# EasyEDA Pro project ProProject_STLink-Edge-v3_2024-03-31.epro

# Schematic st-link  v2-1_1
Create Date: 2024-03-31; Page Name: ST-LINK V2-1; Project Name: ST-LINK V2-1_TYPE-C-edge; Schematic Name: st-link  v2-1_1; Update Date: 2024-03-31; Company: 攻城狮晨哲; Drawed: 沈工; Page Size: A4; Part Number: PCB-002; Reviewed: 沈工; Version: V2.0.1
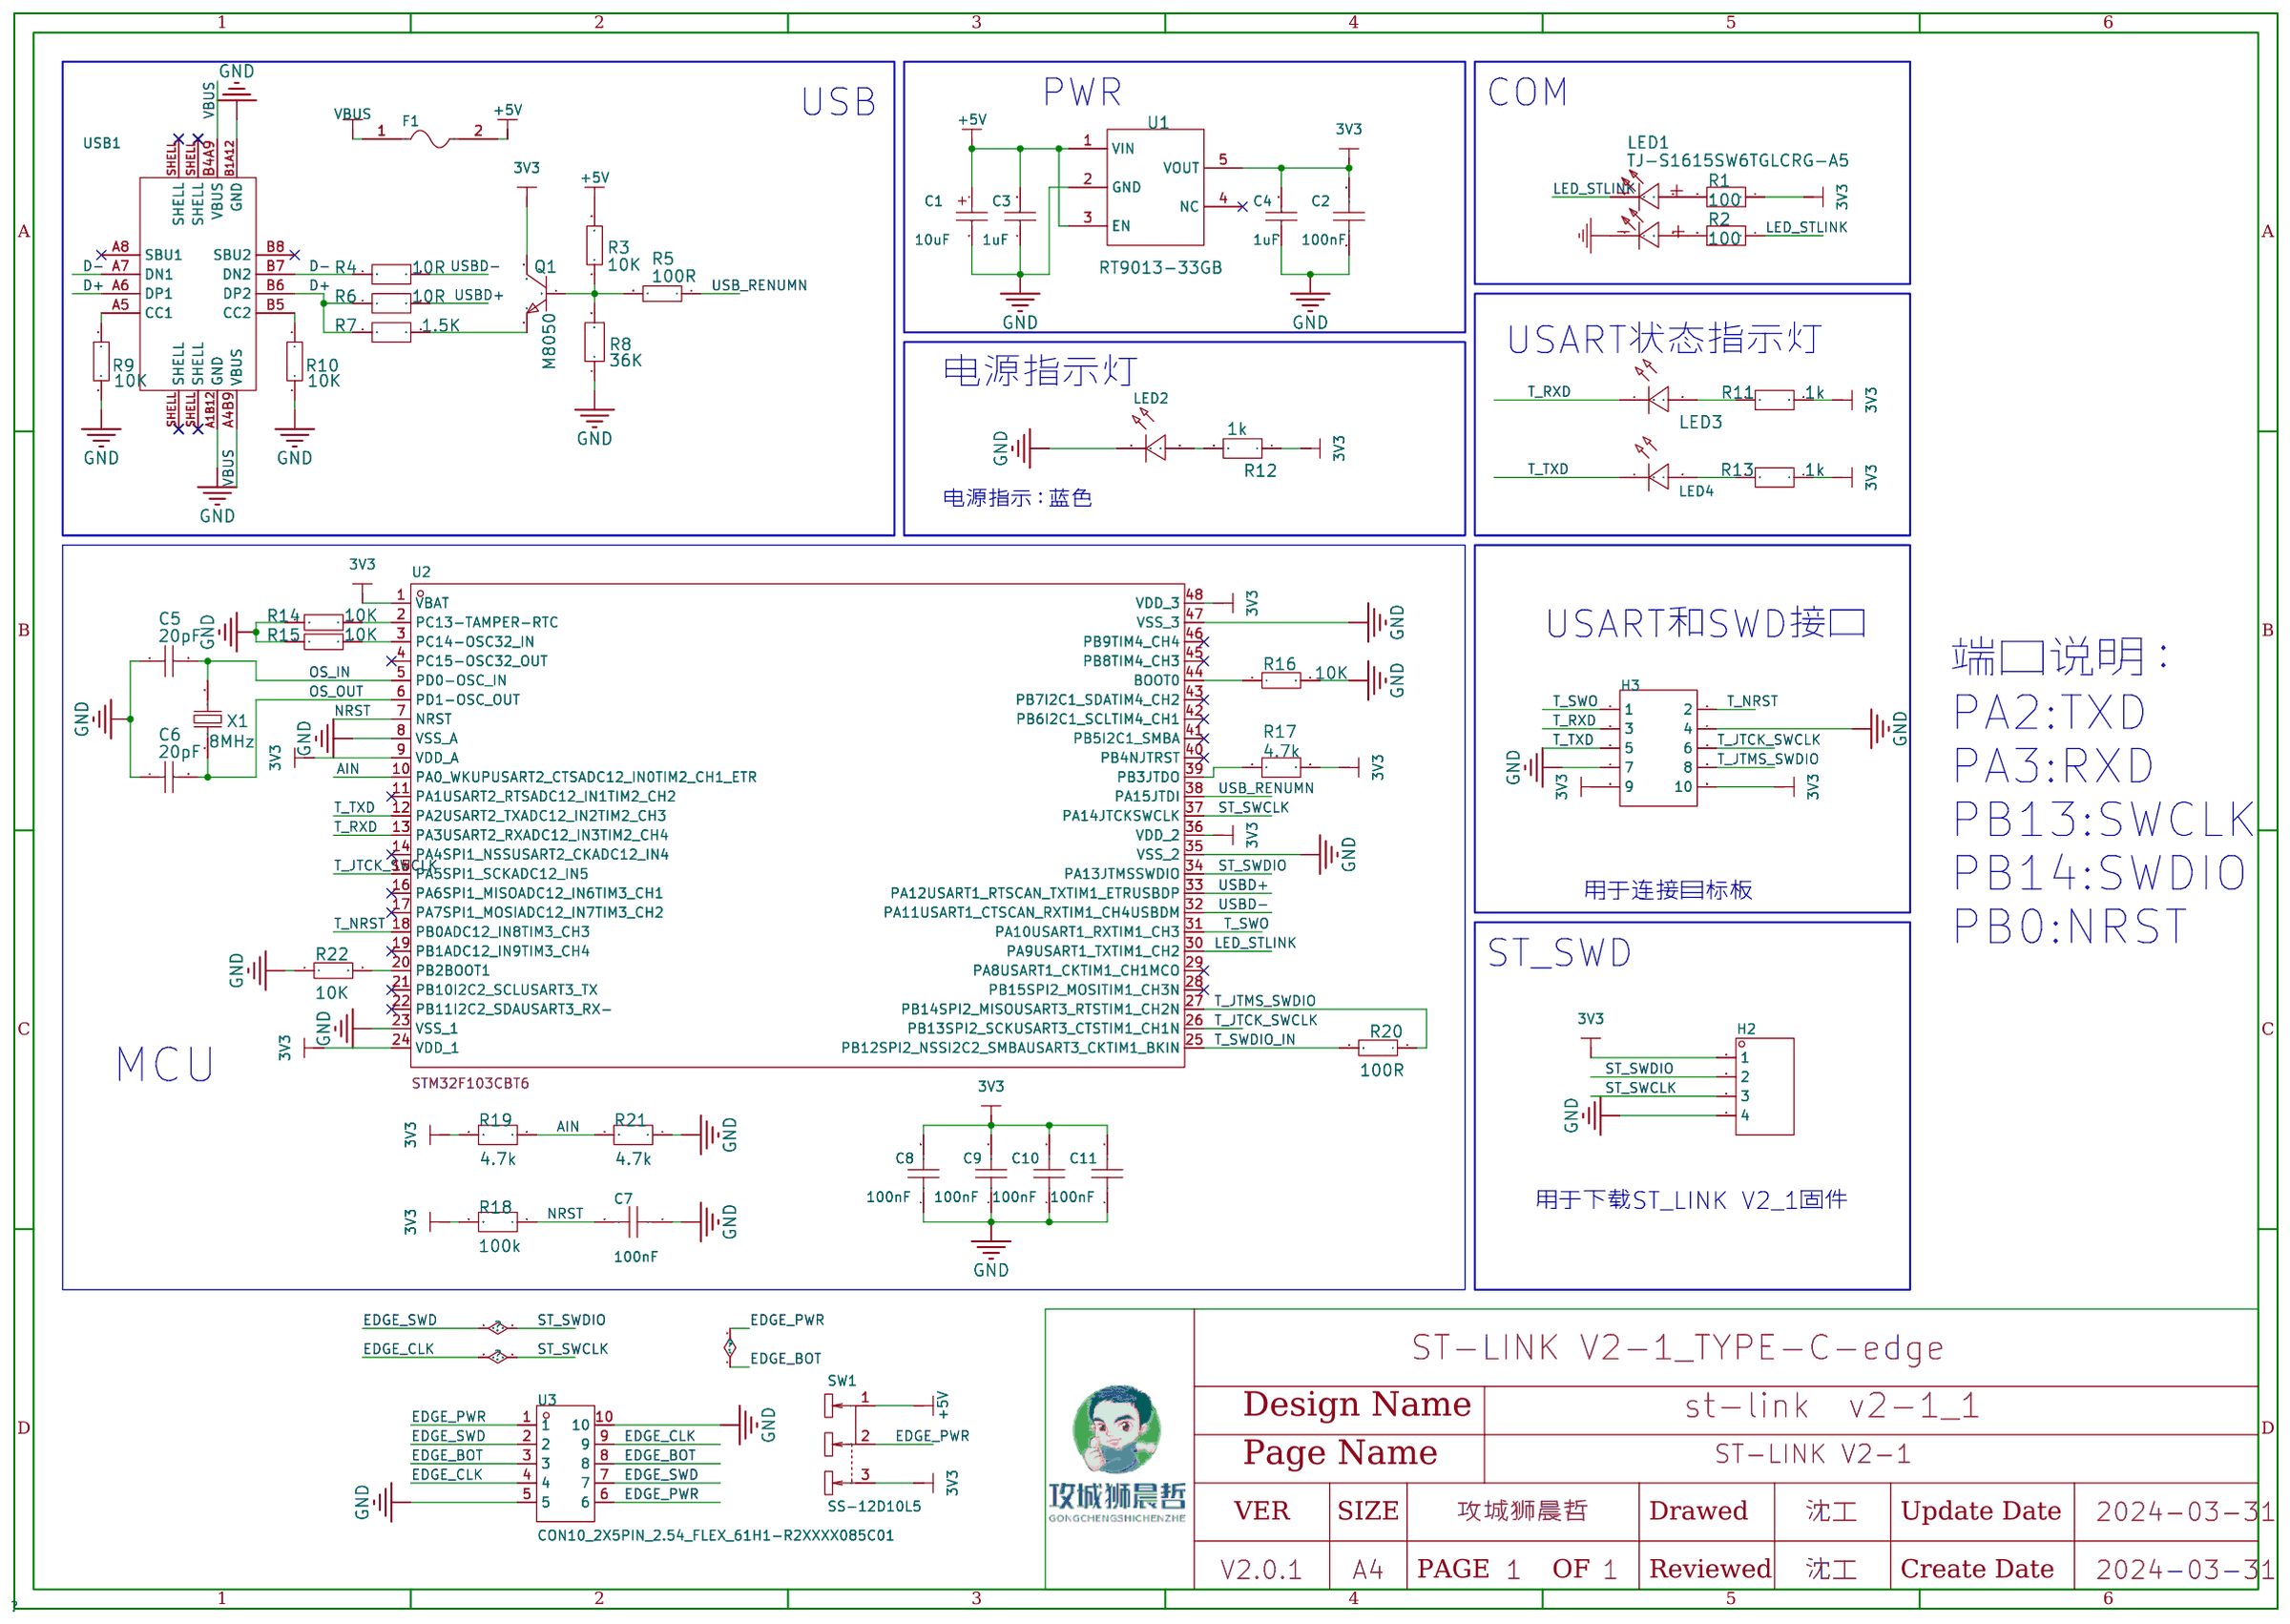
[diagram p0: schematic sheet]

## Parts
C1  10uF  [CASE-A_3216]
C2  100nF  [C0603]
C3  1uF  [C0603]
C4  1uF  [C0603]
C5  20pF  [C0603]
C6  20pF  [C0603]
C7  100nF  [C0603]
C8  100nF  [C0603]
C9  100nF  [C0603]
C10  100nF  [C0603]
C11  100nF  [C0603]
F1  nSMD050  [F1206]
H2  -  [HDR-TH_4P-P2.54-V-M]
H3  -  [HDR-TH_SMD-10P-P2.54]
LED1  TJ-S1615SW6TGLCRG-A5  [LED-ARRAY-SMD_4P-L1.6-W1.5-TR-RD_TJ-S1615SW6TGLCRB-A5]
LED2  -  [LED0603]
LED3  -  [LED0603]
LED4  -  [LED0603]
Q1  M8050  [SOT-23(SOT-23-3)]
R1  100  [R0603]
R2  100  [R0603]
R3  10K  [R0603]
R4  10R  [R0603]
R5  100R  [R0603]
R6  10R  [R0603]
R7  1.5K  [R0603]
R8  36K  [R0603]
R9  10K  [R0603]
R10  10K  [R0603]
R11  1k  [R0603]
R12  1k  [R0603]
R13  1k  [R0603]
R14  10K  [R0603]
R15  10K  [R0603]
R16  10K  [R0603]
R17  4.7k  [R0603]
R18  100k  [R0603]
R19  4.7k  [R0603]
R20  100R  [R0603]
R21  4.7k  [R0603]
R22  10K  [R0603]
SW1  SS-12D10L5  [SW-TH_SS-12D10L5]
U1  RT9013-33GB  [SOT-23-5_L3.0-W1.7-P0.95-LS2.8-BR]
U2  -  [LQFP-48_L7.0-W7.0-P0.50-LS9.0-BL]
U3  CON10_2X5PIN_2.54_FLEX_61H1-R2XXXX085C01  [CONN-TH_10P-P2.54-2X5PIN_2.54_FLEX_61H1]
USB1  -  [USB-3.1-SMD_U262-161N-4BVC11]
X1  8MHz  [OSC-SMD_L5.0-W3.2]

## Library data of the parts
C1 = TAJA106K016RNJ: 容值:10uF;精度:±10%;额定电压:16V;等效串联电阻:3Ω@100kHz;工作温度:-55~+125;; LCSC Part Name: 10uF ±10% 16V; Supplier Part: C7171; Manufacturer: Kyocera AVX; JLCPCB Part Class: Basic Part; Datasheet: https://atta.szlcsc.com/upload/public/pdf/source/20160107/1457707748093.pdf; Supplier: LCSC; Tolerance: ±10%; Rated Voltage: 16V; Equivalent Series Resistance(ESR): 3Ω@100kHz; Operating Temperature: -55~+125
C2 C7-C11 = CC0603KRX7R9BB104: 容值:100nF;精度:±10%;额定电压:50V;温度系数:X7R;; LCSC Part Name: 100nF ±10% 50V; Supplier Part: C14663; Manufacturer: YAGEO(国巨); Supplier Footprint: 0603; JLCPCB Part Class: Basic Part; Datasheet: https://atta.szlcsc.com/upload/public/pdf/source/20170116/1484561234239.pdf; Supplier: LCSC; Tolerance: ±10%; Voltage Rated: 50V; Temperature Coefficient: X7R
C3 C4 = CL10A105KB8NNNC: 容值:1uF;精度:±10%;额定电压:50V;温度系数:X5R;; LCSC Part Name: 1uF ±10% 50V; Supplier Part: C15849; Manufacturer: SAMSUNG(三星); Supplier Footprint: 0603; JLCPCB Part Class: Basic Part; Datasheet: https://atta.szlcsc.com/upload/public/pdf/source/20160103/1457707679084.pdf; Supplier: LCSC; Tolerance: ±10%; Voltage Rated: 50V; Temperature Coefficient: X5R
C5 C6 = 20pF: Supplier: LCSC; Manufacturer Part: CL10C220JB8NNNC; Manufacturer: SAMSUNG; Supplier Part: C1653
F1 = nSMD050: 最大电压:6V;最大电流:100A;保持电流:500mA;跳闸电流:1A;; LCSC Part Name: 0.5A 6V  自恢复保险丝; Supplier Part: C69688; Manufacturer: 台湾陆海; Supplier Footprint: 1206; JLCPCB Part Class: Extended Part; Datasheet: https://atta.szlcsc.com/upload/public/pdf/source/20160331/1459396375403.pdf; Supplier: LCSC; Operating Voltage (Max): 6V; Current Rating (Max): 100A; Hold Current: 500mA; Trip Current: 1A
H2 = B-2100S04P-A110: 间距:2.54mm;总PIN位数:4;排数:1;插针结构:1x4P;行距:-;安装类型:直插;圆针/方针:-;额定电流:-;额定电压:-;配合针长度:6mm;塑高:2.54mm;端接针长度:3mm;触头材质:黄铜;触头镀层:-;工作温度范围:-40~+105;颜色:黑色;; LCSC Part Name: 2.54mm 1x4P; Supplier Part: C124378; Manufacturer: Ckmtw(灿科盟); Supplier Footprint: 插件,P=2.54mm; JLCPCB Part Class: Extended Part; Datasheet: https://atta.szlcsc.com/upload/public/pdf/source/20170821/C124378_1503303307508901532.pdf; Supplier: LCSC; Pitch: 2.54mm; Number of Pins: 4; Number of Rows: 1; Pin Structure: 1x4P; Mounting Type: 直插; Length of Mating Pin: 6mm; Insulation Height: 2.54mm; Length of End Connection Pin: 3mm; Contact Material: 黄铜; Operating Temperature Range: -40~+105; Color: 黑色
H3 = 2*5P header: Supplier: LCSC
LED1 = TJ-S1615SW6TGLCRG-A5: Supplier: LCSC; Supplier Part: C273605; Manufacturer: TOGIALED
LED2 = LED-0603-B
LED3 = LED-0603-R
LED4 = LED-0603-G
Q1 = M8050_C266599: Supplier: LCSC; Supplier Part: C266599; Manufacturer: Bourne Semicon (Shenzhen)
R1 R2 R11-R13 = 1k: Manufacturer Part: RC0603FR-071KL; Supplier: LCSC; Manufacturer: YAGEO; Supplier Part: C22548
R3 R9 R10 R14-R16 R22 = 10K: Supplier: LCSC; Manufacturer: YAGEO; Manufacturer Part: AC0603FR-0710KL; Supplier Part: C116677
R4 R6 = 10R: Manufacturer Part: RC0603FR-0710RL; Supplier: LCSC; Manufacturer: YAGEO; Supplier Part: C109318
R5 R20 = 100R: Supplier: LCSC; Supplier Part: C105588; Manufacturer: YAGEO; Manufacturer Part: RC0603FR-07100RL
R7 = 1.5K: Manufacturer Part: RC0603FR-071K5L; Supplier: LCSC; Manufacturer: YAGEO; Supplier Part: C114668
R8 = 36K: Manufacturer Part: AC0603FR-0736KL; Supplier: LCSC; Manufacturer: YAGEO; Supplier Part: C227841
R17 R19 R21 = 4.7k: Manufacturer Part: AC0603FR-074K7L; Supplier: LCSC; Manufacturer: YAGEO; Supplier Part: C116697
R18 = 100k: Manufacturer Part: AC0603FR-07100KL; Supplier: LCSC; Manufacturer: YAGEO; Supplier Part: C116674
SW1 = SS-12D10L5: 电路结构:单刀双掷;安装方式:直插;开关颜色:黑色;额定电流(DC):3A;额定电压(DC):125V;额定电流(AC):3A;额定电压(AC):125V;机械寿命:1万次;; LCSC Part Name: 柄长5mm 直插双档 滑动开关; Supplier Part: C319012; Manufacturer: XKB Connectivity(中国星坤); Supplier Footprint: 插件; JLCPCB Part Class: 扩展库; Datasheet: https://atta.szlcsc.com/upload/public/pdf/source/20211009/D6412F37AABE6F9459A6EE7FA4DAEADB.pdf; Supplier: LCSC; Circuit: 单刀双掷; Actuator Style: 矩形柱状; Pin Style: PC引脚; Switch Length: 13mm; Switch Width: 6.8mm; Switch Height: 6.4mm; Mounting Style: 直插; Actuator Color: 黑色; Current Rating (DC): 3A; Voltage Rating (DC): 125V; Current Rating (AC): 3A; Voltage Rating (AC): 125V; Mechanical Life: 1万次; Operating Temperature: -40℃~+85℃
U1 = RT9013-33GB: Supplier: LCSC; Manufacturer: RICHTEK; image: //image.lceda.cn/szlcsc/C47773.jpg; Supplier Part: C47773
U2 = STM32F103CBT6: 主频（MAX):72MHz;工作电压:2V ~ 3.6V;; Supplier Part: C8304; Manufacturer: ST(意法半导体); Supplier Footprint: LQFP-48_7x7x05P; JLCPCB Part Class: Extended Part; Datasheet: https://atta.szlcsc.com/upload/public/pdf/source/20140724/1457707170379.pdf; Supplier: LCSC; Speed: 72MHz; Voltage - Supply (Vcc/Vdd): 2V ~ 3.6V; RAM Size: 20KB; Number of I/O: 37; A/D: 16x12bit; PWM: 13; UART/USART: 3 USART; I2C（SMBUS/PMBUS）: 2; USB Device: 1; CAN: 1
U3 = CON10_2X5PIN_2.54_FLEX_61H1-R2XXXX085C01: Supplier Part: C9900013345; Supplier Footprint: 2X5PIN_2.54_FLEX_61H1; JLCPCB Part Class: 扩展库; Supplier: LCSC
USB1 = U262-161N-4BVC11: 连接器类型:Type-C;标准:-;公母:母座;触点数量:16;端口数量:1;; LCSC Part Name: Type-C 母座; Supplier Part: C319148; Manufacturer: XKB Connectivity(中国星坤); Supplier Footprint: SMD; JLCPCB Part Class: Extended Part; Datasheet: https://atta.szlcsc.com/upload/public/pdf/source/20211015/B478CBA0F1623DA36A6CC6918C49C838.pdf; Supplier: LCSC; Connector Type: Type-C; Gender: 母座; Number of Contacts: 16; Number of Ports: 1
X1 = 8MHz: Supplier: LCSC; Manufacturer: TXC; Manufacturer Part: 7A0808LCSC-AHK2G; Supplier Part: C111120

## Nets
3V3: C2.2 C4.2 C8.2 C9.2 C10.2 C11.2 H2.1 H3.9 H3.10 Q1.3(C) R1.1 R11.1 R12.1 R13.1 R17.1 R18.2 R19.2 SW1.3 U1.5(VOUT) U2.1(VBAT) U2.9(VDD_A) U2.24(VDD_1) U2.36(VDD_2) U2.48(VDD_3)
+5V: C1.1 C3.2 F1.2 R3.2 SW1.1 U1.1(VIN) U1.3(EN)
GND: C1.2 C2.1 C3.1 C4.1 C5.1 C6.1 C7.1 C8.1 C9.1 C10.1 C11.1 H2.4 H3.4 H3.7 LED1.4 LED2.1(C) R8.1 R9.1 R10.1 R14.1 R15.1 R16.2 R21.1 R22.1 U1.2(GND) U2.8(VSS_A) U2.23(VSS_1) U2.35(VSS_2) U2.47(VSS_3) U3.5 U3.10 USB1.A1B12(GND) USB1.B1A12(GND)
VBUS: F1.1 USB1.A4B9(VBUS) USB1.B4A9(VBUS)
AIN: R19.1 R21.2 U2.10(PA0_WKUPUSART2_CTSADC12_IN0TIM2_CH1_ETR)
D+: R6.1 R7.1 USB1.A6(DP1) USB1.B6(DP2)
D-: R4.1 USB1.A7(DN1) USB1.B7(DN2)
EDGE_BOT: SW1.2 U3.1 U3.3 U3.6 U3.8
EDGE_CLK: H2.3 U2.37(PA14JTCKSWCLK) U3.4 U3.9
EDGE_SWD: H2.2 U2.34(PA13JTMSSWDIO) U3.2 U3.7
LED_STLINK: LED1.2 R2.1 U2.30(PA9USART1_TXTIM1_CH2)
NRST: C7.2 R18.1 U2.7(NRST)
OS_IN: C5.2 U2.5(PD0-OSC_IN) X1.2
OS_OUT: C6.2 U2.6(PD1-OSC_OUT) X1.1
T_JTCK_SWCLK: H3.6 U2.15(PA5SPI1_SCKADC12_IN5) U2.26(PB13SPI2_SCKUSART3_CTSTIM1_CH1N)
T_JTMS_SWDIO: H3.8 R20.1 U2.27(PB14SPI2_MISOUSART3_RTSTIM1_CH2N)
T_NRST: H3.2 U2.18(PB0ADC12_IN8TIM3_CH3)
T_RXD: H3.3 LED3.1(C) U2.13(PA3USART2_RXADC12_IN3TIM2_CH4)
T_SWDIO_IN: R20.2 U2.25(PB12SPI2_NSSI2C2_SMBAUSART3_CKTIM1_BKIN)
T_SWO: H3.1 U2.31(PA10USART1_RXTIM1_CH3)
T_TXD: H3.5 LED4.1(C) U2.12(PA2USART2_TXADC12_IN2TIM2_CH3)
USB_RENUMN: R5.1 U2.38(PA15JTDI)
USBD+: R6.2 U2.33(PA12USART1_RTSCAN_TXTIM1_ETRUSBDP)
USBD-: R4.2 U2.32(PA11USART1_CTSCAN_RXTIM1_CH4USBDM)
$1N38: R15.2 U2.3(PC14-OSC32_IN)
$1N350: Q1.2(E) R7.2
$1N367: Q1.1(B) R3.1 R5.2 R8.2
$1N516: R17.2 U2.39(PB3JTDO)
$1N517: R16.1 U2.44(BOOT0)
$1N690: LED2.2(A) R12.2
$1N8682: R9.2 USB1.A5(CC1)
$1N8780: R10.2 USB1.B5(CC2)
$1N17783: LED1.1 R1.2
$1N17836: LED1.3 R2.2
$1N45552: R14.2 U2.2(PC13-TAMPER-RTC)
$1N58058: R22.2 U2.20(PB2BOOT1)
Net-(LED3-2): LED3.2(A) R11.2
Net-(LED4-2): LED4.2(A) R13.2

Not connected (* = marked no-connect by the designer): U1 4(NC)*; U2 4(PC15-OSC32_OUT)* 11(PA1USART2_RTSADC12_IN1TIM2_CH2)* 14(PA4SPI1_NSSUSART2_CKADC12_IN4)* 16(PA6SPI1_MISOADC12_IN6TIM3_CH1)* 17(PA7SPI1_MOSIADC12_IN7TIM3_CH2)* 19(PB1ADC12_IN9TIM3_CH4)* 21(PB10I2C2_SCLUSART3_TX)* 22(PB11I2C2_SDAUSART3_RX-)* 28(PB15SPI2_MOSITIM1_CH3N)* 29(PA8USART1_CKTIM1_CH1MCO)* 40(PB4NJTRST)* 41(PB5I2C1_SMBA)* 42(PB6I2C1_SCLTIM4_CH1)* 43(PB7I2C1_SDATIM4_CH2)* 45(PB8TIM4_CH3)* 46(PB9TIM4_CH4)*; USB1 A8(SBU1)* B8(SBU2)* SHELL*

## Notes on the sheet
- PWR
- COM
- USB
- USART状态指示灯
- 电源指示灯
- 电源指示：蓝色
- USART和SWD接口
- 端口说明：
  PA2:TXD
  PA3:RXD
  PB13:SWCLK
  PB14:SWDIO
  PB0:NRST
- 用于连接目标板
- ST_SWD
- MCU
- 用于下载ST_LINK V2_1固件

# Board ST-LINK  V2-1_1
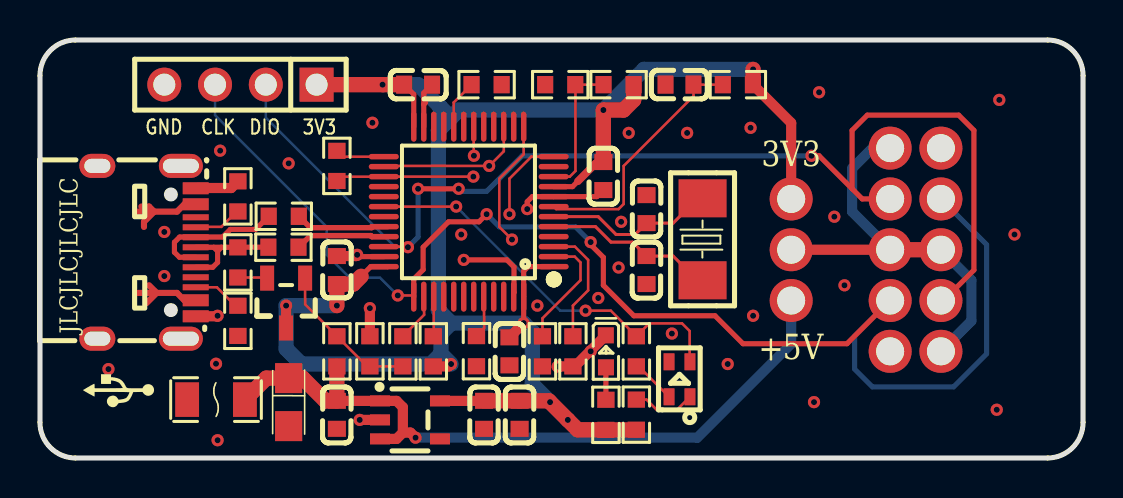
[diagram p1: board, top side]
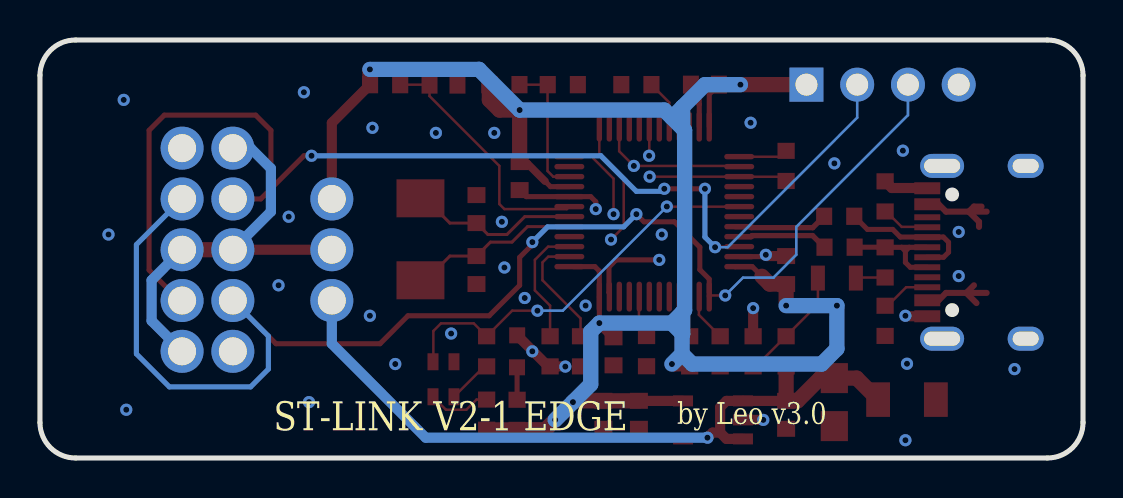
[diagram p2: board, bottom side, seen from below]

Outline 52.19 x 20.9 mm; copper layers: Top Layer, Bottom Layer. Coordinates in mm from the lower left corner of the outline.
Outline path: 0,19.12 0,1.78 arc(0.52,0.52) 1.78,0 50.42,0 arc(51.67,0.52) 52.19,1.78 52.19,19.12 arc(51.67,20.38) 50.42,20.9 1.78,20.9 arc(0.52,20.38) 0,19.12
Stack: Top Layer 0.035mm / Dielectric1 1.51mm FR4 er 4.5 / Bottom Layer 0.035mm

## Design rules (mm)
net USBD-: DP2_USB
net USBD+: DP2_USB
spacing W5 (default): track to track 0.127, other pairs 0.127 to 0.152
track width W5 (default): min 0.127, default 0.127, max 0.254
track width W10: min 0.127, default 0.254, max 2.54
track width W20: min 0.127, default 0.508, max 2.54
differential pair DIFF100 (default): width min 0.127, default 0.267, max 2.54; gap min 0.102, default 0.127
via via6-3 (default): diameter min 0.5, default 0.61, max 10; hole min 0.3, default 0.305, max 5.999
via via8-BGA-16: diameter min 0.406, default 0.406, max 0.406; hole min 0.203, default 0.203, max 0.203
via via8-4: diameter min 0.5, default 0.81, max 10; hole min 0.3, default 0.405, max 6
via VIA12-8: diameter min 0.5, default 1.199, max 10; hole min 0.3, default 0.8, max 5.999
net 3V3 uses W10
net VBUS uses VBUS, W20
net GND uses W20
net +5V uses W20

## Placement (name value [footprint] x y rotation side)
C1  10uF  [CASE-A_3216]  12.44 2.79 270 top
C2  100nF  [C0603]  24 2.16 90 top
C3  1uF  [C0603]  14.86 2.16 90 top
C4  1uF  [C0603]  22.22 2.16 90 top
C5  20pF  [C0603]  30.35 9.4 90 top
C6  20pF  [C0603]  30.35 12.45 270 top
C7  100nF  [C0603]  32 18.67 0 top
C8  100nF  [C0603]  28.19 14.1 90 top
C9  100nF  [C0603]  14.86 9.4 270 top
C10  100nF  [C0603]  23.49 5.33 90 top
C11  100nF  [C0603]  18.92 18.67 180 top
F1  nSMD050  [F1206]  8.81 2.92 0 top
H2  -  [HDR-TH_4P-P2.54-V-M]  10.03 18.67 180 top
LED1  TJ-S1615SW6TGLCRG-A5  [LED-ARRAY-SMD_4P-L1.6-W1.5-TR-RD_TJ-S1615SW6TGLCRB-A5]  32 3.94 270 top
LED2  -  [LED0603]  28.32 5.33 270 top
Q1  M8050  [SOT-23(SOT-23-3)]  12.32 6.48 180 top
R1  100  [R0603]  29.84 2.17 90 top
R2  100  [R0603]  29.84 5.33 270 top
R3  10K  [R0603]  14.86 5.33 270 top
R4  10R  [R0603]  12.2 12.09 0 top
R5  100R  [R0603]  18.16 5.33 270 top
R6  10R  [R0603]  12.18 10.54 0 top
R7  1.5K  [R0603]  9.9 9.78 270 top
R8  36K  [R0603]  16.51 5.33 270 top
R9  10K  [R0603]  9.9 13.08 270 top
R10  10K  [R0603]  9.9 6.86 90 top
R12  1k  [R0603]  28.32 2.16 90 top
R14  10K  [R0603]  25.14 5.33 90 top
R15  10K  [R0603]  26.67 5.33 90 top
R16  10K  [R0603]  21.84 5.34 270 top
R17  4.7k  [R0603]  19.68 5.33 90 top
R18  100k  [R0603]  34.92 18.67 0 top
R19  4.7k  [R0603]  28.95 18.67 0 top
R20  100R  [R0603]  14.86 14.61 90 top
R21  4.7k  [R0603]  26.03 18.67 0 top
R22  10K  [R0603]  22.35 18.67 180 top
SW1  SS-12D10L5  [SW-TH_SS-12D10L5]  37.59 10.41 90 top
U1  RT9013-33GB  [SOT-23-5_L3.0-W1.7-P0.95-LS2.8-BR]  18.52 1.91 180 top
U2  -  [LQFP-48_L7.0-W7.0-P0.50-LS9.0-BL]  21.45 12.32 90 top
U3  CON10_2X5PIN_2.54_FLEX_61H1-R2XXXX085C01  [CONN-TH_10P-P2.54-2X5PIN_2.54_FLEX_61H1]  45.08 10.41 0 top
USB1  -  [USB-3.1-SMD_U262-161N-4BVC11]  5.33 10.29 270 top
X1  8MHz  [OSC-SMD_L5.0-W3.2]  33.16 10.94 270 top

## Footprints (pads in the part's own frame, mm; a bottom-side part is the same pattern mirrored in y, then rotated)
C0603
  rect 0.8x0.9 smd: 1(-0.7,0) 2(0.7,0)
CASE-A_3216
  rect 1.5x1.359 smd: 1(-1.2,0) 2(1.2,0)
CONN-TH_10P-P2.54-2X5PIN_2.54_FLEX_61H1
  round 2.15 hole 1.4: 1(-2.54,5.08) 2(-2.54,2.54) 3(-2.54,0) 4(-2.54,-2.54) 5(-2.54,-5.08) 6(0,-5.08) 7(0,-2.54) 8(0,0) 9(0,2.54) 10(0,5.08)
F1206
  rect 1.192x1.727 smd: 1(-1.446,0) 2(1.446,0)
HDR-TH_4P-P2.54-V-M
  rect 1.7x1.7 hole 1.1: 1(-3.81,0)
  round 1.7 hole 1.1: 2(-1.27,0) 3(1.27,0) 4(3.81,0)
LED0603
  rect 0.8x0.8 smd: 1(-0.799,-0.004) 2(0.799,0.004)
LED-ARRAY-SMD_4P-L1.6-W1.5-TR-RD_TJ-S1615SW6TGLCRB-A5
  rect 0.85x0.55 smd: 1(0.875,0.525) 2(-0.875,0.525) 3(0.875,-0.525) 4(-0.875,-0.525)
LQFP-48_L7.0-W7.0-P0.50-LS9.0-BL
  oval 0.27x1.5 smd: 1(-2.75,-4.25) 2(-2.25,-4.25) 3(-1.75,-4.25) 4(-1.25,-4.25) 5(-0.75,-4.25) 6(-0.25,-4.25) 7(0.25,-4.25) 8(0.75,-4.25) 9(1.25,-4.25) 10(1.75,-4.25) 11(2.25,-4.25) 12(2.75,-4.25) 25(2.75,4.25) 26(2.25,4.25) 27(1.75,4.25) 28(1.25,4.25) 29(0.75,4.25) 30(0.25,4.25) 31(-0.25,4.25) 32(-0.75,4.25) 33(-1.25,4.25) 34(-1.75,4.25) 35(-2.25,4.25) 36(-2.75,4.25)
  oval 1.5x0.27 smd: 13(4.25,-2.75) 14(4.25,-2.25) 15(4.25,-1.75) 16(4.25,-1.25) 17(4.25,-0.75) 18(4.25,-0.25) 19(4.25,0.25) 20(4.25,0.75) 21(4.25,1.25) 22(4.25,1.75) 23(4.25,2.25) 24(4.25,2.75) 37(-4.25,2.75) 38(-4.25,2.25) 39(-4.25,1.75) 40(-4.25,1.25) 41(-4.25,0.75) 42(-4.25,0.25) 43(-4.25,-0.25) 44(-4.25,-0.75) 45(-4.25,-1.25) 46(-4.25,-1.75) 47(-4.25,-2.25) 48(-4.25,-2.75)
OSC-SMD_L5.0-W3.2
  rect 1.9x2.4 smd: 1(-2.05,0) 2(2.05,0)
R0603
  rect 0.806x0.864 smd: 1(-0.753,0) 2(0.753,0)
SOT-23(SOT-23-3)
  rect 0.7x1.25 smd: 1(-0.95,-2.519) 2(0.95,-2.519) 3(0,-0.021)
SOT-23-5_L3.0-W1.7-P0.95-LS2.8-BR
  rect 1x0.55 smd: 1(1.5,-0.95) 2(1.5,0) 3(1.5,0.95) 4(-1.5,0.95) 5(-1.5,-0.95)
SW-TH_SS-12D10L5
  round 2.15 hole 1.4: 1(0,0) 2(-2.54,0) 3(2.54,0)
USB-3.1-SMD_U262-161N-4BVC11
  rect 0.6x1.3 smd: A1B12(-3.2,2.462) A4B9(-2.4,2.462) B1A12(3.2,2.462) B4A9(2.4,2.462)
  rect 0.3x1.3 smd: A5(-1.25,2.462) A6(-0.25,2.462) A7(0.25,2.462) A8(1.25,2.462) B5(1.75,2.462) B6(0.75,2.462) B7(-0.75,2.462) B8(-1.75,2.462)
  oval 1.2x2.2 hole 0.7x1.8: SHELL(-4.32,1.719) SHELL(4.32,1.719)
  oval 1.2x1.8 hole 0.7x1.3: SHELL(-4.32,-2.462) SHELL(4.32,-2.462)

## Nets
As in the schematic, except:
+5V: C1.1 C3.2 F1.2 R3.2 SW1.2 U1.1 U1.3
EDGE_BOT: SW1.1 U3.1 U3.3 U3.6 U3.8

Pads without a net: U1 4; U2 4 11 14 16 17 19 21 22 28 29 40 41 42 43 45 46; USB1 A8 B8 SHELL

## Via types
v1: diameter 0.61, hole 0.305, Top Layer to Bottom Layer, 58 vias

## Routing (per net, layer and track width the routed paths; a pad name or vN(x,y) marks a point on that pad's centre or on a via; arc(x,y) is an arc through that point)
3V3: length 101.6
  Top Layer w0.254: C11.2 18.7,18.19 U2.24 ; 17.41,9.57 17.41,9.56 16.55,9.56 16.07,9.09 ; 26.92,13.84 26.65,13.57 U2.9 ; v1(24.2,6.75) U2.48 24.2,9.35 24.43,9.57 25.51,9.57
  Top Layer w0.381: C8.2 28.13,14.73 27.81,14.73 26.92,13.84
  Top Layer w0.508: C10.2 v1(24.2,6.75) ; v1(20.57,4.7) 20.45,4.58 R17.1 ; C4.2 22.22,2.86 U1.5 ; R18.2 37.59,16.76 SW1.3 ; v1(12.32,7.62) Q1.3
  Top Layer w0.762: R18.2 35.68,18.68 v1(35.68,19.43) ; 16.07,9.09 15.68,8.7 C9.2 v1(14.86,7.62) ; C11.2 v1(17.14,18.67) H2.1 ; R19.2 29.71,17.91 29.2,17.4 v1(28.19,17.4) C8.2 ; C4.2 C2.2 25.46,2.86 v1(25.52,2.79) v1(26.41,1.91) 26.91,1.41 28.31,1.41 R12.1 29.83,1.4 29.84,1.41
  Bottom Layer w0.762: v1(35.68,19.43) 30.22,19.43 v1(28.19,17.4) 20.95,17.4 20.57,17.02 ; 20.04,7.29 19.94,7.39 19.94,16.38 20.04,16.48 ; 20.04,7.29 20.04,6.2 ; 20.04,7.29 20.58,6.75 ; 20.58,6.75 v1(24.2,6.75) 24.64,6.31 24.64,3.68 v1(25.52,2.79) v1(26.41,1.91) ; 20.58,6.75 20.04,6.2 ; 20.04,17.55 20.57,17.02 ; 20.04,17.55 20.04,16.48 ; 20.04,17.55 18.92,18.67 v1(17.14,18.67) ; 20.57,17.02 20.04,16.48 ; 20.06,5.21 v1(20.57,4.7) ; 20.06,5.21 19.56,4.7 13.08,4.7 12.32,5.46 v1(12.32,7.62) v1(14.86,7.62) ; 20.06,5.21 20.06,6.17 20.04,6.2
+5V: length 36.7
  Top Layer w0.508: 18.16,1.27 17.84,0.95 U1.3 ; 18.16,1.27 18.54,1.27 v1(18.79,1.02) ; 18.16,1.27 18.16,2.54 17.84,2.86 U1.1 14.99,2.86
  Top Layer w0.762: R3.2 C3.2 14.28,2.86 13.15,3.99 C1.1 11.33,3.99 10.25,2.92
  Bottom Layer w0.508: SW1.2 37.59,5.72 32.89,1.02 v1(18.79,1.02)
GND: length 22
  Top Layer w0.254: 19.2,17.68 19.2,18.25 C11.1 ; 19.2,17.68 U2.23 ; 19.2,17.68 19.3,17.78 ; C8.1 27.86,13.07 U2.8 24.64,13.07 24.38,12.81 v1(24.38,12.45) ; 23.71,8.27 23.72,8.28 23.72,9.55 23.37,9.91 v1(21.21,9.91) ; v1(15.87,10.16) 15.96,10.07 U2.35
  Top Layer w0.508: R9.1 9.57,13.5 7.87,13.5 ; v1(15.87,10.16) 15.81,10.1 C9.1 ; v1(16.51,7.49) R8.1 ; 7.81,7.09 8.86,7.09 v1(8.89,7.11) ; v1(16,1.91) U1.2 ; LED2.1 27.56,5.37 v1(27.56,5.33) 27.52,5.33 26.76,4.58 25.91,4.58 v1(25.91,4.57)
  vias: v1(3.43,4.45) v1(6.22,11.3) v1(6.22,9.1) v1(8.81,4.71) v1(8.89,0.89) v1(9.01,15.37) v1(12.44,14.73) v1(16.63,16.76) v1(21.08,11.18) v1(24.89,7.62) v1(27.94,8) v1(28.95,9.53) v1(29.08,11.81) v1(29.46,16.26) v1(31.62,6.22) v1(32.38,16.26) v1(34.41,4.7) v1(35.56,16.51) v1(35.68,7.11) v1(38.73,2.79) v1(38.99,18.29) v1(39.75,12.06) v1(40.26,8.64) v1(47.88,2.41) v1(48,17.91) v1(48.77,11.18)
VBUS: length 9.3
  Top Layer w0.305: 5.2,11.56 5.2,11.81 5.71,12.32 ; 5.71,12.32 6.86,12.32 7.24,12.7 7.87,12.7 ; 5.71,12.32 4.82,12.32 ; 5.71,12.32 5.46,12.57 5.08,12.57 ; 5.84,8.25 5.46,8.64 ; 5.84,8.25 4.82,8.25 ; 5.84,8.25 5.33,7.75 ; 5.84,8.25 6.86,8.25 7.22,7.89 USB1.B4A9
AIN: length 6.9
  Top Layer w0.127: R19.1 R21.2 26.79,18.66 26.79,14.35 26.51,14.07 U2.10
D+: length 5.9
  Top Layer w0.254: 8.89,10.35 8.89,9.78 8.65,9.54 7.81,9.54 ; 8.89,10.35 8.7,10.54 ; 8.89,10.35 9.08,10.54 ; 8.7,10.54 7.81,10.54 ; 8.7,10.54 9.08,10.54 ; R6.1 9.91,10.54 R7.1 9.9,10.54 9.08,10.54
D-: length 6.9
  Top Layer w0.254: 11.45,12.09 10.79,11.43 9.52,11.43 9.14,11.05 6.99,11.05 6.73,10.79 6.73,10.29 6.98,10.04 7.81,10.04
EDGE_BOT: length 21
  Top Layer w0.508: SW1.1 U3.3
  Top Layer w0.762: U3.3 U3.8
  Bottom Layer w0.508: U3.8 46.61,8.89 46.61,6.86 U3.6 ; U3.1 41.65,15.49 40.64,14.48 40.64,12.32 U3.3
EDGE_CLK: length 67.7
  Top Layer w0.127: 18.7,8.27 18.71,8.13 v1(17.9,8.13)
  Top Layer w0.254: v1(27.56,10.8) 27.56,10.67 28.19,10.03 28.19,8.64 29.72,7.11 33.78,7.11 35.18,5.72 40.38,5.72 U3.4 ; 18.7,8.27 18.7,8.95 19.17,9.42 19.17,10.54 20.44,11.81 21.97,11.81 v1(22.35,12.19) ; 18.7,8.13 U2.37
  Bottom Layer w0.127: v1(17.9,8.13) 17.02,9.02 15.49,9.02 14.35,10.16 14.35,11.56 8.76,17.14 H2.3
  Bottom Layer w0.254: U3.4 40.76,6.1 40.76,4.45 41.65,3.56 45.72,3.56 47.37,5.21 47.37,10.67 U3.9 ; v1(22.35,12.19) 22.98,11.56 26.79,11.56 v1(27.56,10.8)
EDGE_SWD: length 60
  Top Layer w0.127: v1(18.41,10.54) 18.38,10.57 U2.34
  Top Layer w0.254: 40.64,13.46 40.64,16.38 41.4,17.14 45.97,17.14 46.73,16.38 46.73,9.4 45.21,7.87 U3.7 ; 40.64,13.46 38.99,15.11 v1(38.61,15.11) ; 40.64,13.46 41.15,12.95 U3.2 ; v1(20.95,13.46) v1(18.92,13.46)
  Bottom Layer w0.127: v1(18.41,10.54) 17.78,10.54 11.3,17.02 11.3,18.67
  Bottom Layer w0.254: v1(18.41,10.54) 18.92,11.05 v1(18.92,13.46) ; v1(20.95,13.46) 21.08,13.34 22.35,13.34 24.13,15.11 v1(38.61,15.11)
LED_STLINK: length 19.8
  Top Layer w0.127: v1(20.83,12.57) 20.82,12.57 17.41,12.57 ; v1(27.3,7.37) 28.56,7.37 29.84,6.09 ; R2.1 30.49,6.73 32.13,6.73 32.51,6.35 32.51,4.83 LED1.2
  Bottom Layer w0.127: v1(20.83,12.57) 26.03,7.37 v1(27.3,7.37)
NRST: length 12.5
  Top Layer w0.127: U2.7 25.83,12.45 28.95,12.45 29.21,12.7 29.21,14.61 32.7,18.1 C7.2 R18.1
OS_IN: length 8.6
  Top Layer w0.152: 33.16,8.89 32.89,8.89 31.68,10.1 C5.2 29.65,10.8 28.57,10.8 27.8,11.57 U2.5
OS_OUT: length 8.6
  Top Layer w0.152: X1.1 32.92,12.99 31.68,11.75 C6.2 29.78,11.18 28.83,11.18 27.93,12.07 U2.6
T_JTCK_SWCLK: length 7.4
  Top Layer w0.127: 17.41,14.57 17.45,14.61 v1(22.48,14.61) 23.21,15.34 23.21,16.56 U2.15
T_JTMS_SWDIO: length 6.9
  Top Layer w0.127: v1(21.69,14.07) 17.41,14.07 17.41,14.06 15.07,14.06 R20.1
T_NRST: length 1.5
  Top Layer w0.127: v1(21.71,15.11) 21.7,15.12 U2.18
T_RXD: length 6.4
  Top Layer w0.127: U2.13 24.2,15.19 22.98,13.97 22.98,11.56 v1(23.62,10.92)
T_SWDIO_IN: length 2.7
  Top Layer w0.127: R20.2 14.86,15.36 15.16,15.06 17.41,15.06 17.41,15.07
T_TXD: length 4.4
  Top Layer w0.127: v1(23.49,12.19) 23.49,13.97 24.59,15.07 U2.12
USB_RENUMN: length 2.6
  Top Layer w0.127: R5.1 18.16,6.1 19.22,7.16 19.22,8.26 19.21,8.27
USBD+: length 4.7
  Top Layer w0.267: 17.41,11.07 16.61,11.07 16.56,11.12 13.53,11.12 12.95,10.54 R6.2
USBD-: length 4.7
  Top Layer w0.267: 12.95,12.09 13.53,11.52 16.59,11.52 16.65,11.57 17.41,11.57
$1N38: length 6.1
  Top Layer w0.127: 26.67,6.09 26.67,7.62 27.43,8.38 27.43,9.91 26.77,10.57 U2.3
$1N350: length 1.5
  Top Layer w0.127: R7.2 11.29,9.02 11.32,9 Q1.2
$1N367: length 7.5
  Top Layer w0.127: R5.2 R8.2 16.37,4.58 14.87,6.09 R3.1 14.86,6.1 13.27,7.69 Q1.1
$1N516: length 2
  Top Layer w0.127: U2.39 19.7,6.11 R17.2
$1N517: length 2.3
  Top Layer w0.127: R16.1 22.22,6.48 22.22,8.26 22.21,8.27
$1N690: length 1.6
  Top Layer w0.254: 28.32,4.53 28.32,4.53 R12.2
$1N8682: length 2.4
  Top Layer w0.127: R9.2 9.84,12.33 9.07,11.56 7.88,11.56 7.87,11.55
$1N8780: length 2.5
  Top Layer w0.127: 7.81,8.54 8.85,8.54 9.78,7.61 9.9,7.61
$1N17783: length 3.2
  Top Layer w0.127: R1.2 30.35,2.92 30.86,2.41 31.88,2.41 LED1.1
$1N17836: length 2.3
  Top Layer w0.127: LED1.3 29.96,4.58 R2.2
$1N45552: length 5.9
  Top Layer w0.127: U2.2 26.76,10.07 27.05,9.78 27.05,8.89 25.14,6.98 R14.2
$1N58058: length 2.5
  Top Layer w0.127: R22.2 20.7,17.78 U2.20

## Copper pours and planes (outline as drawn; the poured copper is in the pictures)
GND on Top Layer: -0.89,21.59 52.96,21.59 52.96,-0.76 -0.89,-0.76
GND on Bottom Layer: -0.38,21.97 52.58,21.97 52.58,-1.4 -0.38,-1.4
VBUS on Top Layer: 4.19,2.03 4.19,12.7 5.59,12.7 5.59,4.59 6.36,3.81 7.92,3.81 7.92,2.03

## Text on the board
Bottom Silkscreen Layer: by Leo v3.0 | ST-LINK V2-1 EDGE
Top Silkscreen Layer: GND | CLK | DIO | 3V3 | JLCJLCJLCJLC | +5V
Drill Drawing Layer: Mark | Count | 2 | 4 | 106 | Size | 27.6x51.2mil(0.700x1.300mm) | 27.6x70.9mil(0.700x1.800mm) | 43.3x43.3mil(1.100x1.100mm) | 12.0mil(0.305mm) | Plated | PTH | Shape | Slot | Round | Via/Pad | Pad | Via | Pad Shape | Oval | (Mixed) | Layer Pair | Top Layer-Bottom Layer
